# Altium schematic sheet MotionDetectorProgJIG.SchDoc
size A4
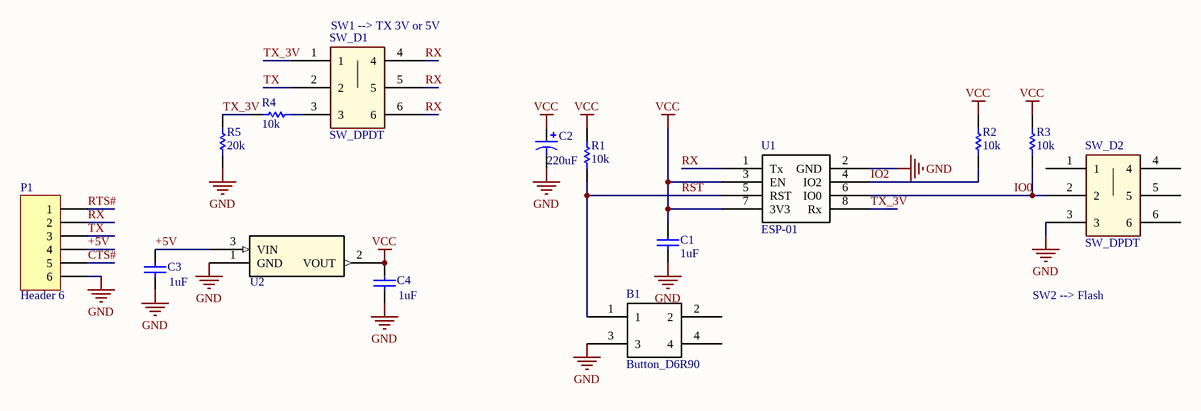
[diagram p0: MotionDetectorProgJIG.SchDoc]

## Parts
B1  Button_D6R90  [Button_D6R90]
C1  value 1uF  [CAP_0804]  (hidden comment: Cap)
C2  value 220uF  [U2-K]  (hidden comment: Cap Pol1)
C3  value 1uF  [CAP_0804]  (hidden comment: Cap)
C4  value 1uF  [CAP_0804]  (hidden comment: Cap)
P1  Header 6  [HDR1X6]
R1  value 10k  [RES_0804_panasonic]  (hidden comment: Res1)
R2  value 10k  [RES_0804_panasonic]  (hidden comment: Res1)
R3  value 10k  [RES_0804_panasonic]  (hidden comment: Res1)
R4  value 10k  [RES_0804_panasonic]  (hidden comment: Res1)
R5  value 20k  [RES_0804_panasonic]  (hidden comment: Res1)
SW_D1  SW_DPDT  [SW_DPDT]
SW_D2  SW_DPDT  [SW_DPDT]
U1  ESP-01  [ESP-01]
U2  Voltage Reg  [SOT-23]  (value not drawn)

## Nets
GND: B1.3 C1.2 C2.2 C3.1 C4.1 P1.6 R5.2 SW_D2.3 U1.2(GND) U2.1(GND)
VCC: C1.1 C2.1 C4.2 R1.2 R2.2 R3.2 U1.3(EN) U1.7(3V3) U2.2(VOUT)
+5V: C3.2 P1.4 U2.3(VIN)
CTS#: P1.5
IO0: R3.1 SW_D2.2 U1.6(IO0)
IO2: R2.1 U1.4(IO2)
RST: B1.1 R1.1 U1.5(RST)
RTS#: P1.1
RX: P1.2 SW_D1.4 SW_D1.5 SW_D1.6 U1.1(Tx)
TX: P1.3 SW_D1.2
TX_3V: R4.2 R5.1 SW_D1.1 U1.8(Rx)
NetR4_1: R4.1 SW_D1.3

Not connected (* = marked no-connect by the designer): B1 2 4; SW_D2 1 4 5 6

## Notes on the sheet
- (near SW_D1) SW1 --> TX 3V or 5V
- SW2 --> Flash

## Library data of the parts
C1 C3 C4 = Cap: Capacitor; Published: 8-Jun-2000; LatestRevisionDate: 17-Jul-2002; LatestRevisionNote: Re-released for DXP Platform.; PackageReference: RAD-0.3; Publisher: Altium Limited; PackageDescription: Radial Cap, Thru-Hole; 2 Leads; 0.3 in Pin Spacing
C2 = Cap Pol1: Polarized Capacitor (Radial); Published: 8-Jun-2000; LatestRevisionDate: 17-Jul-2002; LatestRevisionNote: Re-released for DXP Platform.; PackageReference: RB7.6-15; Publisher: Altium Limited; PackageDescription: Polarized Capacitor (Radial); 2 Leads
P1 = Header 6: Header, 6-Pin; LatestRevisionDate: 17-Jul-2002; LatestRevisionNote: Re-released for DXP Platform.; Publisher: Altium Limited
R1-R5 = Res1: Resistor; Published: 8-Jun-2000; LatestRevisionDate: 17-Jul-2002; LatestRevisionNote: Re-released for DXP Platform.; PackageReference: AXIAL-0.3; Publisher: Altium Limited; PackageDescription: Axial Device, Thru-Hole; 2 Leads; 0.3 in Pin Spacing
U2 = AP2120N-3.3TRG1: Vendor: Diodes Inc; Built_By: EMA_UL_Team; Manufacturer_Part_Number: AP2120N-3.3TRG1; RefDes: RefDes; Type: DEV; Value: Value